# EAGLE design DAC900E (EAGLE 6.5.0)
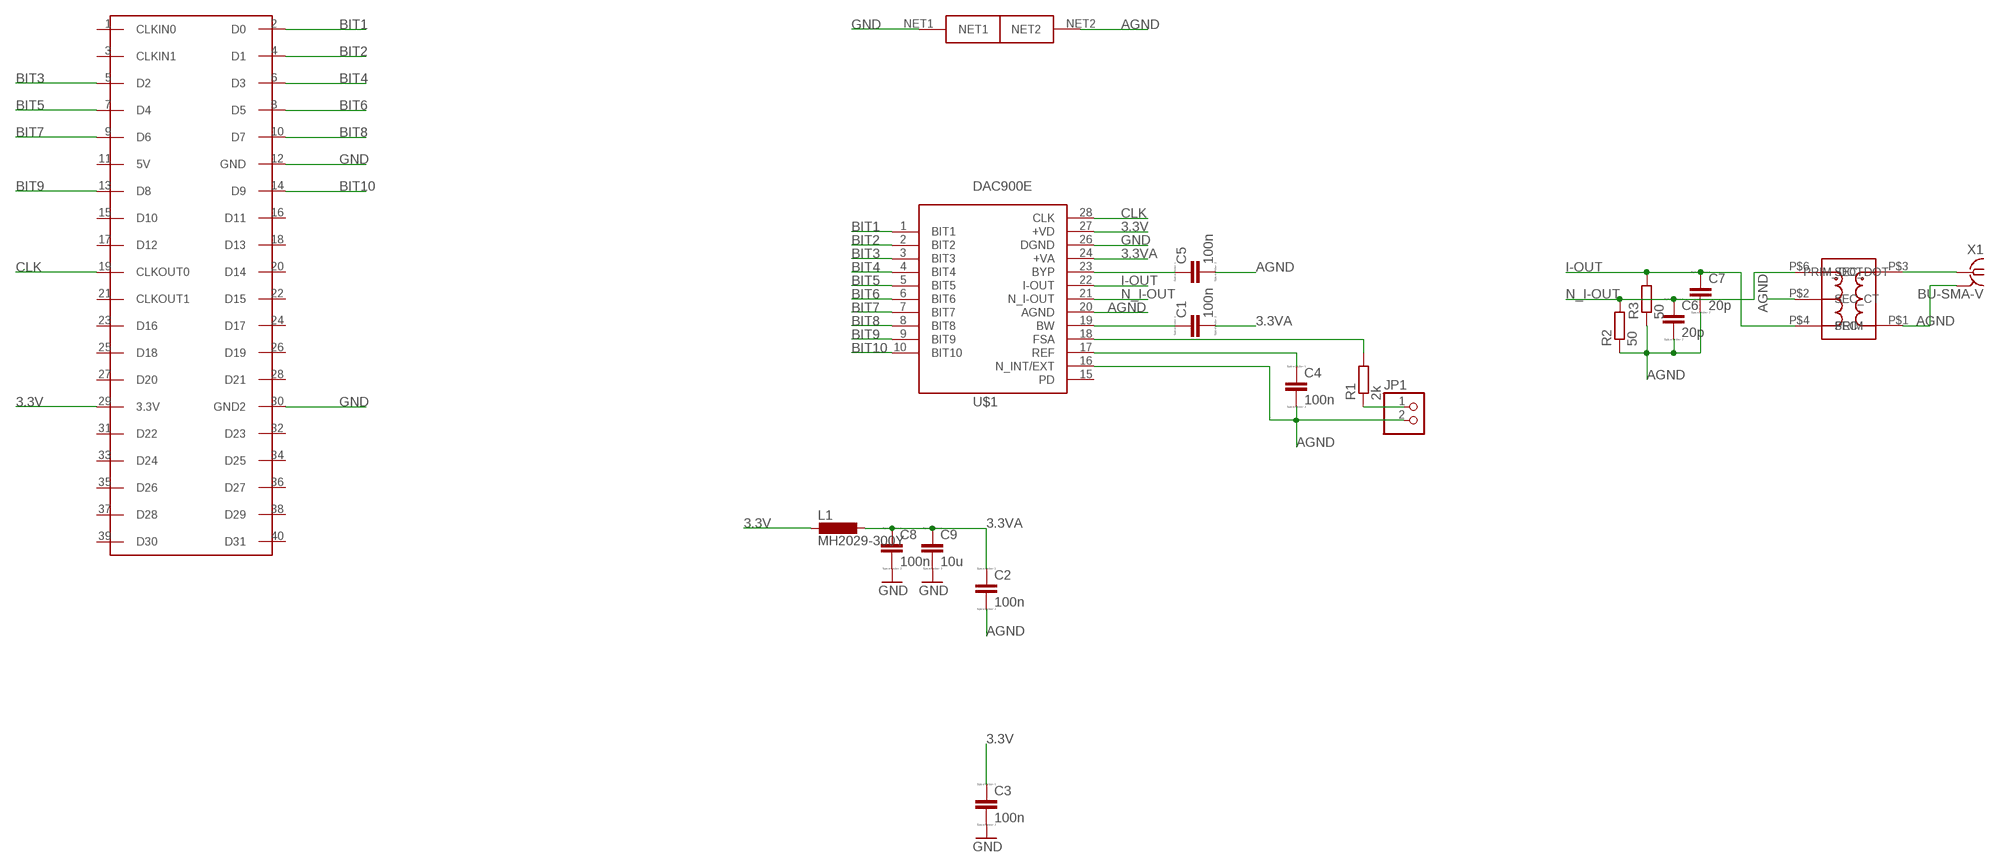
[diagram p0: schematic, sheet 1]

## Parts
C1  100n  C_SMD  [C0805]
C2  100n  C_SMD  [C0805]
C3  100n  C_SMD  [C0805]
C4  100n  C_SMD  [C0805]
C5  100n  C_SMD  [C0805]
C6  20p  C_SMD  [C0805]
C7  20p  C_SMD  [C0805]
C8  100n  C_SMD  [C0805]
C9  10u  C_SMD  [C0805]
JP1  PINHD-1X2  [1X02]
L1  MH2029-300Y  L_0805  [R0805]
R1  2k  R-EU_R0805  [R0805]
R2  50  R-EU_R0805  [R0805]
R3  50  R-EU_R0805  [R0805]
U$1  DAC900E  [TSSOP28]
U$2  NET_TIE  [NET-TIE]
U$3  FPGA_GPIO_DE0  [2X20]
U$4  ADT1-1WT  [CD542]
X1  BU-SMA-V  [BU-SMA-V]

## Nets
3.3V: C3.1 L1.2 U$1.27(+VD) U$3.29(3.3V)
3.3VA: C1.2 C2.1 C8.1 C9.1 L1.1 U$1.24(+VA)
AGND: C2.2 C4.2 C5.2 C6.2 C7.2 JP1.2 R2.1 R3.1 U$1.16(N_INT/EXT) U$1.20(AGND) U$2.NET2 U$4.P$1(PRIM) U$4.P$2(SEC_CT) X1.2 X1.3 X1.4 X1.5
BIT1: U$1.1(BIT1) U$3.2(D0)
BIT2: U$1.2(BIT2) U$3.4(D1)
BIT3: U$1.3(BIT3) U$3.5(D2)
BIT4: U$1.4(BIT4) U$3.6(D3)
BIT5: U$1.5(BIT5) U$3.7(D4)
BIT6: U$1.6(BIT6) U$3.8(D5)
BIT7: U$1.7(BIT7) U$3.9(D6)
BIT8: U$1.8(BIT8) U$3.10(D7)
BIT9: U$1.9(BIT9) U$3.13(D8)
BIT10: U$1.10(BIT10) U$3.14(D9)
CLK: U$1.28(CLK) U$3.19(CLKOUT0)
GND: C3.2 C8.2 C9.2 U$1.26(DGND) U$2.NET1 U$3.12(GND) U$3.30(GND2)
I-OUT: C7.1 R3.2 U$1.22(I-OUT) U$4.P$4(SEC)
N$1: JP1.1 R1.1
N$2: U$4.P$3(PRIM_DOT) X1.1
N$16: C5.1 U$1.23(BYP)
N$19: C1.1 U$1.19(BW)
N$20: R1.2 U$1.18(FSA)
N$21: C4.1 U$1.17(REF)
N_I-OUT: C6.1 R2.2 U$1.21(N_I-OUT) U$4.P$6(SEC_DOT)
Unconnected: U$1.15(PD) U$3.1(CLKIN0) U$3.3(CLKIN1) U$3.11(5V) U$3.15(D10) U$3.16(D11) U$3.17(D12) U$3.18(D13) U$3.20(D14) U$3.21(CLKOUT1) U$3.22(D15) U$3.23(D16) U$3.24(D17) U$3.25(D18) U$3.26(D19) U$3.27(D20) U$3.28(D21) U$3.31(D22) U$3.32(D23) U$3.33(D24) U$3.34(D25) U$3.35(D26) U$3.36(D27) U$3.37(D28) U$3.38(D29) U$3.39(D30) U$3.40(D31)

## Library data of the parts
C1-C9 = 0myLib:C_SMD: CAPACITOR, European symbol; SPICEMODEL: NONE; SPICEPREFIX: C
JP1 = 0myLib:PINHD-1X2: PIN HEADER
L1 = 0myLib:L_0805
R1-R3 = 0myLib:R-EU_: RESISTOR, European symbol
U$1 = 0myLib:DAC900E
U$2 = 0myLib:NET_TIE
U$3 = 0myLib:FPGA_GPIO_DE0
U$4 = 0myLib:ADT1-1WT
X1 = 0myLib:BU-SMA-V: FEMALE SMA CONNECTOR Radiall distributor RS 112-3794; OC_FARNELL: unknown; OC_NEWARK: unknown

## Board
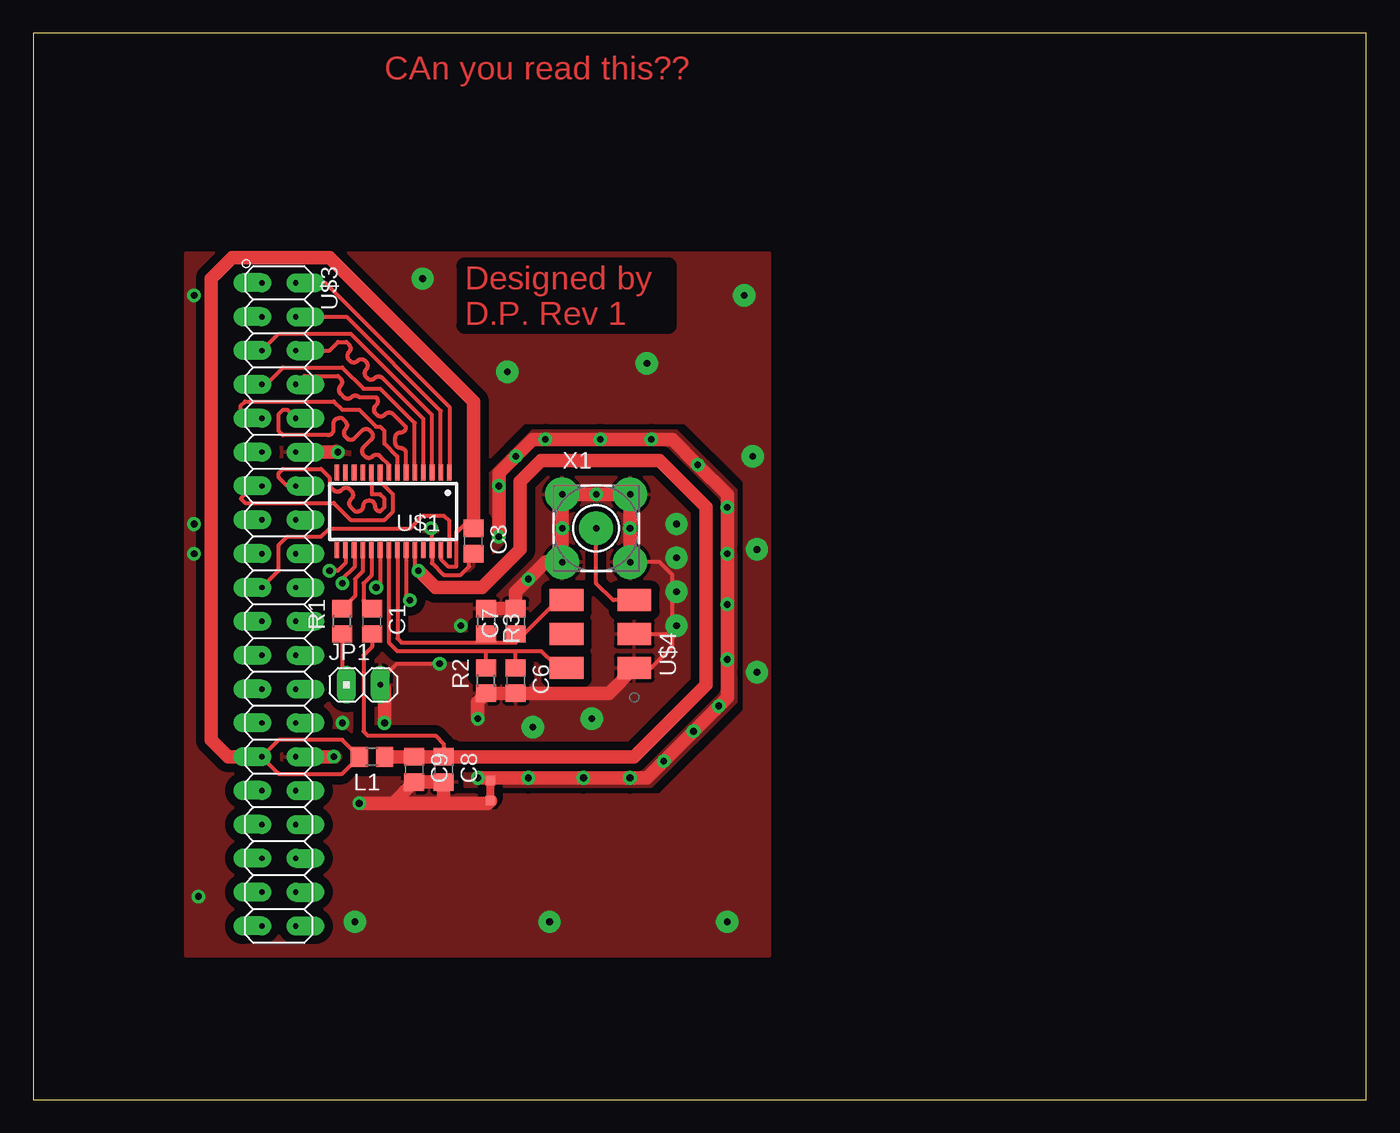
[diagram p1: board, top side]
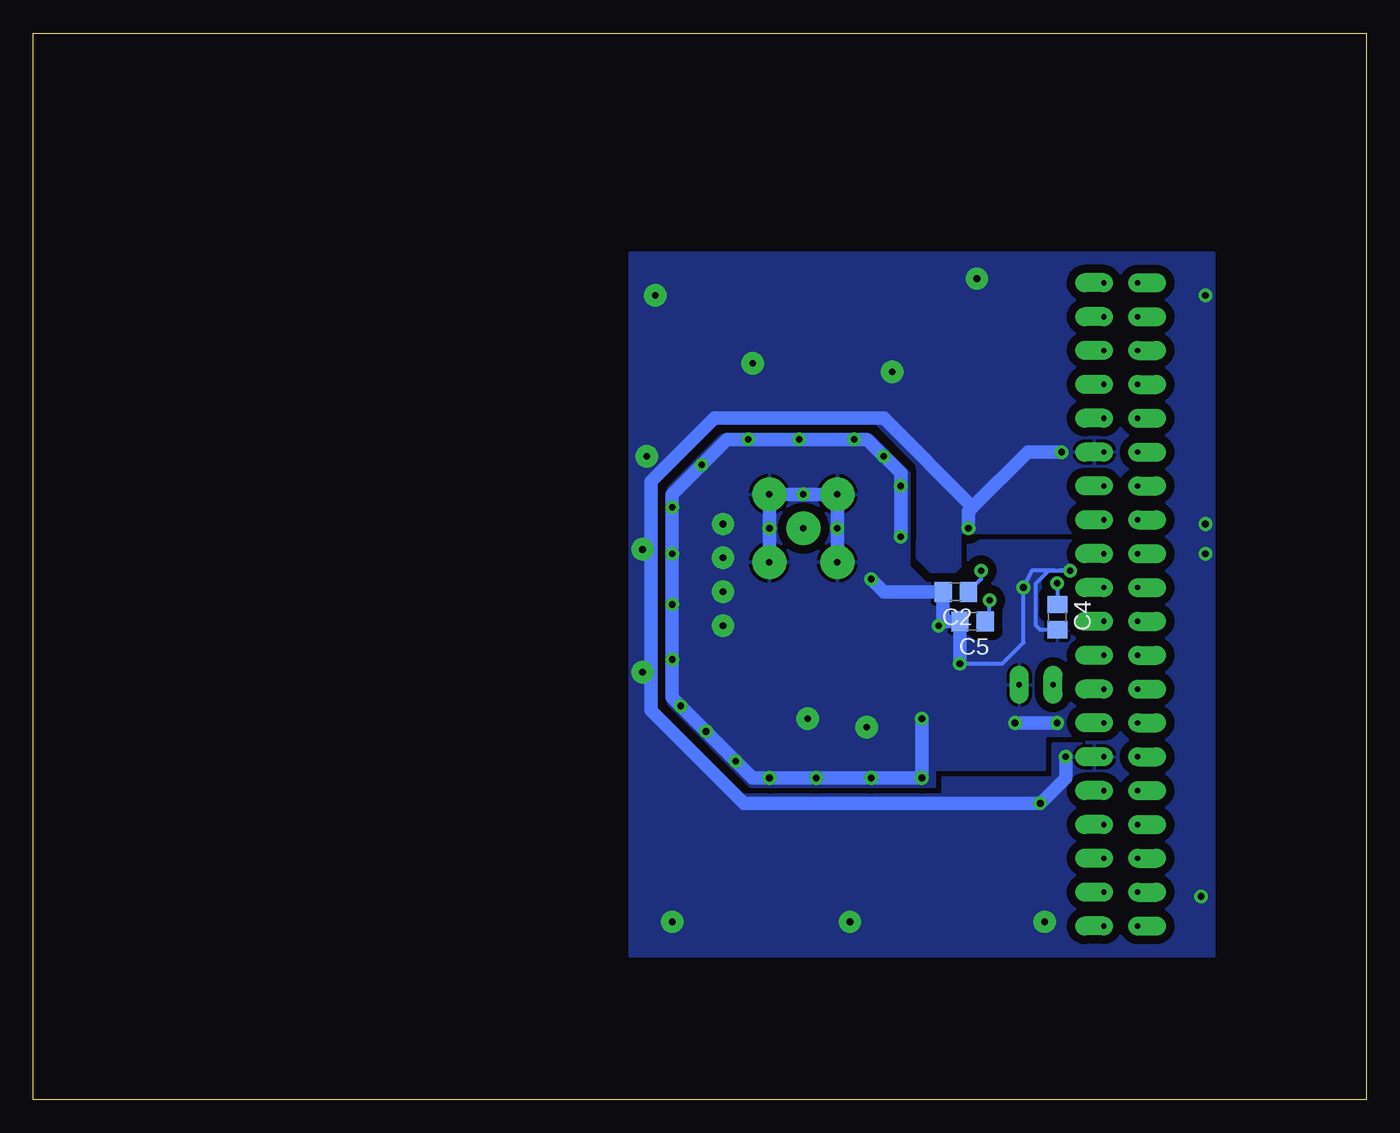
[diagram p2: board, bottom side, seen from below]

Size 100 x 80 mm. Coordinates in mm from the lower left corner, seen from the top.
Outline: 0,0 100,0 100,80 0,80 0,0
Copper layers (1*16): Top 0.035mm / dielectric 1.5mm / Bottom 0.035mm
Design rules "FinalizeAreaFill": minimum track width 12mil, minimum drill 1.4mm, track to track 25mil, track to pad 25mil, pad to pad 8mil, via to via 8mil, smd to smd 8mil, copper to edge 40mil, drill to drill 8mil, minimum pad ring 10mil, minimum via ring 8mil, stop-mask expansion 4mil, vias tented up to drill 0mil, thermal gap 10mil

### Footprints (pad centres in the part's own frame; a part is rotated, then mirrored left to right if it is on the bottom)
C0805 = smd 1.3 x 1.5: 1 -0.95,0; 2 0.95,0
1X02 = drill 0.4 pad 1.422 long: 1 -1.27,0; 2 1.27,0
R0805 = smd 1.3 x 1.5: 1 -0.95,0; 2 0.95,0
TSSOP28 = smd 0.35 x 1.2: 1 -4.225,-2.9; 2 -3.575,-2.9; 3 -2.925,-2.9; 4 -2.275,-2.9; 5 -1.625,-2.9; 6 -0.975,-2.9; 7 -0.325,-2.9; 8 0.325,-2.9; 9 0.975,-2.9; 10 1.625,-2.9; 11 2.275,-2.9; 12 2.925,-2.9; 13 3.575,-2.9; 14 4.225,-2.9; 15 4.225,2.9; 16 3.575,2.9; 17 2.925,2.9; 18 2.275,2.9; 19 1.625,2.9; 20 0.975,2.9; 21 0.325,2.9; 22 -0.325,2.9; 23 -0.975,2.9; 24 -1.625,2.9; 25 -2.275,2.9; 26 -2.925,2.9; 27 -3.575,2.9; 28 -4.225,2.9
NET-TIE = smd 0.711 x 0.711: NET1 -0.77,0; NET2 0.73,0
2X20 = drill 0.4 pad 1.422 offset: 1 -24.13,-1.27; 2 -24.13,1.27; 3 -21.59,-1.27; 4 -21.59,1.27; 5 -19.05,-1.27; 6 -19.05,1.27; 7 -16.51,-1.27; 8 -16.51,1.27; 9 -13.97,-1.27; 10 -13.97,1.27; 11 -11.43,-1.27; 12 -11.43,1.27; 13 -8.89,-1.27; 14 -8.89,1.27; 15 -6.35,-1.27; 16 -6.35,1.27; 17 -3.81,-1.27; 18 -3.81,1.27; 19 -1.27,-1.27; 20 -1.27,1.27; 21 1.27,-1.27; 22 1.27,1.27; 23 3.81,-1.27; 24 3.81,1.27; 25 6.35,-1.27; 26 6.35,1.27; 27 8.89,-1.27; 28 8.89,1.27; 29 11.43,-1.27; 30 11.43,1.27; 31 13.97,-1.27; 32 13.97,1.27; 33 16.51,-1.27; 34 16.51,1.27; 35 19.05,-1.27; 36 19.05,1.27; 37 21.59,-1.27; 38 21.59,1.27; 39 24.13,-1.27; 40 24.13,1.27
CD542 = smd 1.651 x 2.54: P$1 -2.54,-2.54; P$2 0,-2.54; P$3 2.54,-2.54; P$4 2.54,2.54; P$5 0,2.54; P$6 -2.54,2.54
BU-SMA-V = drill 0.5 pad 2.54: 1 0,0; 2 -2.55,2.55; 3 2.55,2.55; 4 2.55,-2.55; 5 -2.55,-2.55

### Placement (x,y rotation side)
C1  25.4,35.88 270 top
C2  30.8,38.1 180 bottom
C3  33.02,41.91 270 top
C4  23.18,36.2 270 bottom
C5  29.53,35.88 180 bottom
C6  36.2,31.43 270 top
C7  36.2,35.88 90 top
C8  30.8,24.77 270 top
C9  28.57,24.77 270 top
JP1  24.77,31.11 0 top
L1  25.4,25.72 180 top
R1  23.18,35.88 90 top
R2  33.97,31.43 90 top
R3  33.97,35.88 270 top
U$1  26.99,44.13 180 top
U$2  34.29,23.18 90 top
U$3  18.41,37.15 270 top
U$4  42.55,34.92 90 top
X1  42.23,42.86 0 top

### Tracks (layer width: path | path; a pad name or v marks a point on that pad's centre or on a via)
3.3V
  Top 0.305: U$1.27 30.56,40.56 31.11,40.01 31.75,40.01 31.75,42.55 32.38,43.18 32.7,43.18 C3.1 | L1.2 | L1.2 23.18,26.99 18.41,26.99 U$3.29 18.41,24.45 23.18,24.45 L1.2
  Top 1.016: U$3.29 14.61,25.72 13.34,26.99 13.34,61.59 14.92,63.18 22.23,63.18 33.02,52.39 C3.1
3.3VA  (via drill 0.5 pad 1.02)
  Top 0.305: U$1.24 28.61,39.97 v28.89,39.69 | C1.2 25.4,33.97 24.77,33.34 24.77,27.62 25.08,27.3 30.16,27.3 30.8,26.67 C8.1
  Top 1.016: L1.1 | v28.89,39.69 30.16,38.42 33.66,38.42 36.51,41.27 36.51,46.35 38.1,47.94 46.99,47.94 50.48,44.45 50.48,31.11 45.09,25.72 L1.1 | L1.1 C9.1 C8.1
  Bottom 0.305: v28.89,39.69 28.89,39.05 C2.1
AGND  (via drill 0.5 pad 1.02, 0.5 pad 1.68)
  Top 0.305: U$1.20 26.01,38.71 v25.72,38.42 | U$1.16 23.41,40.24 22.86,39.69 v22.23,39.69 | U$4.P$1 46.35,32.38 47.94,33.97 47.94,35.24 | 47.94,35.24 47.94,39.37 46.99,40.32 44.79,40.32 X1.4 | U$4.P$2 47.62,34.92 47.94,35.24 | JP1.2 26.04,31.43 27.3,32.7 v30.48,32.7 | U$2.NET2 v33.34,24.13
  Top 1.016: X1.4 X1.3 X1.2 X1.5 39.67,40.32 38.42,40.32 v37.15,39.05 36.2,38.1 C7.2 R3.1 | U$4.P$1 43.18,30.48 C6.2 R2.1 33.34,29.85 v33.34,28.57 | v33.34,24.13 v37.15,24.13 v41.27,24.13 v44.77,24.13 46.04,24.13 v47.31,25.4 v49.53,27.62 v51.44,29.53 52.07,30.16 v52.07,33.02 v52.07,37.15 v52.07,40.96 v52.07,44.45 52.07,45.4 v49.85,47.62 47.94,49.53 v46.35,49.53 v42.55,49.53 v38.42,49.53 37.47,49.53 v36.2,48.26 34.92,46.99 v34.92,46.04 v34.92,42.23 | JP1.2 26.35,30.8 v26.35,28.26
  Bottom 0.305: C4.2 24.45,35.24 24.77,35.56 24.77,38.73 23.81,39.69 v22.23,39.69 25.08,39.69 v25.72,38.42 25.72,34.29 27.3,32.7 v30.48,32.7
  Bottom 1.016: X1.5 39.68,45.39 X1.2 44.77,45.4 44.77,40.32 | v30.48,32.7 C5.2 31.75,35.88 C2.2 36.2,38.1 v37.15,39.05 | v34.92,42.23 34.92,46.99 37.47,49.53 47.94,49.53 52.07,45.4 52.07,30.16 46.04,24.13 v33.34,24.13 v33.34,28.57 | v26.35,28.26 v23.18,28.26
  other vias: 41.91,28.57 39.69,42.86 42.23,45.4 44.77,42.86 48.26,43.18 48.26,40.64 48.26,38.1 48.26,35.56 37.47,27.94 32.07,35.56
  pour Bottom: 21.59,41.91 21.59,27.3 24.13,27.3 24.13,24.77 32.38,24.77 32.38,23.5 46.35,23.5 52.7,29.84 52.7,45.72 48.26,50.16 37.47,50.16 34.29,46.99 34.29,40.01 33.02,38.73 30.48,38.73 29.84,39.37 29.84,41.91
  pour Top: 22.23,41.91 21.59,41.91 21.59,27.3 24.13,27.3 24.13,24.77 32.38,24.77 32.38,23.5 46.35,23.5 52.7,29.84 52.7,45.72 48.26,50.16 37.47,50.16 34.29,46.99 34.29,40.01 33.66,39.37 33.02,38.73 32.38,38.73 30.48,38.73 29.84,39.37 29.84,41.91
BIT1
  Top 0.305: U$3.2 21.91,61.28 31.21,51.97 U$1.1
BIT2
  Top 0.305: U$3.4 23.5,58.74 30.56,51.67 U$1.2
BIT3
  Top 0.305: U$3.5 18.41,57.47 23.81,57.47 29.91,51.37 U$1.3
BIT4
  Top 0.305: U$3.6 22.23,56.2 22.86,56.83 23.5,56.83 23.68,56.65 arc-90 23.68,56.07 arc90 23.68,55.5 23.75,55.43 arc90 24.33,55.43 arc-90 24.9,55.43 24.97,55.35 arc-90 24.97,54.78 arc90 24.97,54.2 25.04,54.13 arc90 25.62,54.13 arc-90 26.19,54.13 29.26,51.06 U$1.4
BIT5
  Top 0.305: U$3.7 17.46,53.66 18.73,54.93 23.18,54.93 24.77,53.34 26.04,53.34 28.61,50.76 U$1.5
BIT6
  Top 0.305: U$1.6 27.96,48.48 arc90 27.56,48.88 arc-90 27.15,49.29 27.15,49.65 arc-90 27.56,50.05 arc90 27.96,50.46 26.99,51.44 arc90 26.41,51.44 26.35,51.38 arc-90 25.78,51.38 25.67,51.48 arc-90 25.67,52.06 25.73,52.12 arc90 25.73,52.69 25.72,52.7 24.45,52.7 arc90 23.87,52.7 arc-90 23.3,52.7 23.04,52.96 arc-90 23.04,53.53 arc90 23.04,54.11 22.86,54.29 20.32,54.29 U$3.8
BIT7
  Top 0.305: U$1.7 27.3,48.26 26.35,49.21 26.35,50.16 26.04,50.48 25.72,50.48 24.45,51.75 23.18,51.75 22.54,52.39 15.88,52.39 15.56,52.07 15.56,51.75 16.19,51.12 U$3.9
BIT8
  Top 0.305: U$1.8 26.66,47.63 26.04,48.26 arc90 25.46,48.26 arc-90 24.89,48.26 24.78,48.37 arc-90 24.78,48.94 25.36,49.52 arc90 25.36,50.09 25.25,50.2 arc90 24.67,50.2 24.1,49.62 arc-90 23.52,49.62 23.42,49.73 arc-90 23.42,50.3 arc90 23.42,50.88 23.18,51.12 22.92,51.12 arc90 22.51,50.71 22.51,50.25 arc-90 22.11,49.85 18.73,49.85 18.41,50.16 18.41,51.44 18.73,51.75 19.05,51.75 U$3.10
BIT9
  Top 0.305: U$1.9 26.01,46.38 26.99,45.4 26.99,44.13 26.35,43.5 23.81,43.5 22.54,44.77 15.88,44.77 15.56,45.09 16.51,46.04 U$3.13
BIT10
  Top 0.305: U$3.14 19.05,46.04 18.41,46.67 18.41,46.99 18.73,47.31 21.59,47.31 22.23,46.67 22.23,46.04 22.54,45.72 arc90 23.12,45.72 23.18,45.78 arc-90 23.75,45.78 23.88,45.65 arc-90 23.88,45.08 23.82,45.02 arc90 23.82,44.44 24.13,44.13 24.35,44.13 arc90 24.76,44.54 arc-90 25.16,44.95 25.22,44.95 arc-90 25.63,44.54 arc90 26.04,44.13 26.35,44.45 26.35,45.09 26.04,45.4 25.4,45.4 25.4,46.99 U$1.10
CLK
  Top 0.305: U$3.19 18.41,39.69 18.41,41.59 19.05,42.23 21.59,42.23 22.23,42.86 28.26,42.86 29.21,43.81 30.8,43.81 31.21,43.4 U$1.28
GND  (via drill 0.5 pad 1.02, 0.5 pad 1.68)
  Top 0.305: C3.2 32.7,40.64 32.7,40.01 32.07,39.37 30.8,39.37 29.91,40.26 U$1.26 29.91,42.8 v29.84,42.86
  Top 1.016: U$3.12 v22.86,48.58 | U$3.30 v22.54,25.72 | 26.98,22.23 C9.2 C8.2 30.8,22.54 31.11,22.23 | U$2.NET1 34.11,22.23 31.11,22.23 | v24.45,22.23 31.11,22.23
  Bottom 1.016: v22.86,48.58 25.4,48.58 29.53,44.45 | 29.53,44.45 29.84,44.13 v29.84,42.86 | v22.54,25.72 22.54,24.13 v24.45,22.23 46.67,22.23 53.66,29.21 53.66,46.35 48.9,51.12 36.2,51.12 29.53,44.45
  other vias: 24.13,13.34 38.73,13.34 52.07,13.34 54.29,32.07 54.29,41.27 53.98,48.26 46.04,55.24 53.34,60.33 35.56,54.61 29.21,61.59 12.06,60.33 12.06,43.18 12.06,40.96 12.38,15.24
  pour Bottom: 11.43,41.91 20.95,41.91 20.95,42.55 30.48,42.55 30.48,40.01 31.11,39.37 32.38,39.37 33.66,40.64 33.66,47.62 36.83,50.8 48.9,50.8 53.34,46.35 55.24,46.35 55.24,63.5 11.43,63.5
  pour Top: 11.43,41.91 20.95,41.91 20.95,42.55 30.48,42.55 30.48,40.01 31.11,39.37 32.38,39.37 33.66,40.64 33.66,47.62 36.83,50.8 48.9,50.8 53.34,46.35 55.24,46.35 55.24,63.5 11.43,63.5
  pour Top: 20.95,41.91 20.95,26.67 23.5,26.67 23.5,24.13 31.75,24.13 31.75,22.86 46.99,22.86 53.34,29.21 53.34,46.35 55.24,46.35 55.24,10.79 11.43,10.79 11.43,41.91
  pour Bottom: 20.95,41.91 20.95,26.67 23.5,26.67 23.5,24.13 31.75,24.13 31.75,22.86 46.99,22.86 53.34,29.21 53.34,46.35 55.24,46.35 55.24,10.79 11.43,10.79 11.43,41.91
I-OUT
  Top 0.305: 33.97,34.29 27.62,34.29 27.31,34.6 U$1.22 | 33.97,34.29 35.88,34.29 | 35.88,34.29 36.2,34.29 39.37,37.47 U$4.P$4 | R3.2 33.97,34.29 | C7.1 36.2,34.61 35.88,34.29
N$1
  Top 0.305: R1.1 23.18,31.43 JP1.1
N$2
  Top 0.305: U$4.P$3 43.5,37.47 42.23,38.73 X1.1
N$16  (via drill 0.5 pad 1.02)
  Top 0.305: U$1.23 27.96,37.76 v28.26,37.47
  Bottom 0.305: C5.1 28.26,36.2 v28.26,37.47
N$19
  Top 0.305: U$1.19 25.36,39.33 24.77,38.73 24.77,37.47 C1.1
N$20
  Top 0.305: U$1.18 24.71,39.63 24.13,39.05 24.13,37.78 R1.2
N$21  (via drill 0.5 pad 1.02)
  Top 0.305: v23.18,38.73 23.18,39.05 24.13,40.01 24.13,41.16 U$1.17
  Bottom 0.305: v23.18,38.73 C4.1
N_I-OUT
  Top 0.305: 33.97,33.66 27.3,33.66 26.66,34.3 U$1.21 | 33.97,33.66 36.2,33.66 | 36.2,33.66 38.1,33.66 39.05,32.7 39.69,32.7 U$4.P$6 | R2.2 33.97,33.66 | C6.1 36.2,33.66

### Text on the board
Top: CAn you read this?? | Designed by / D.P. Rev 1